# Altium schematic sheet ESP32_Schematic.SchDoc: ESP32-Wroom32D schematic diagram
size A4; Date: 01/10/2024; Author: Filip Kulka; Revision: 1.0; SheetNumber: 1; SheetTotal: 1; Desc: ESP32 WiFi module custom board for a mobile robot project.; BOM: ESP32_Board - Mobile Robot.BomDoc
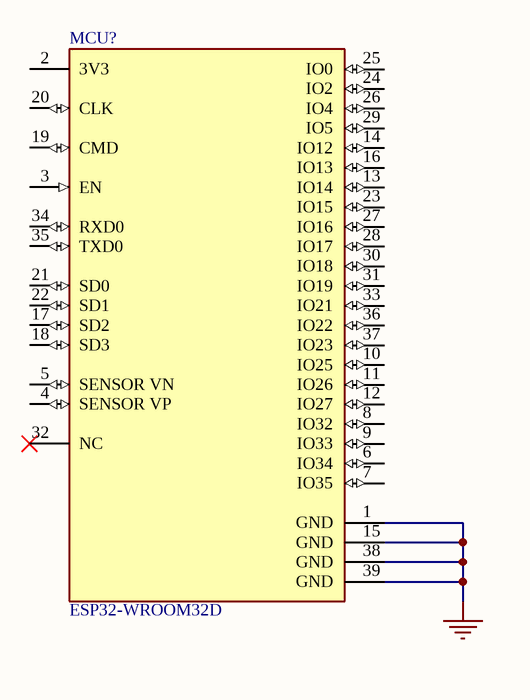
[diagram p0: ESP32_Schematic.SchDoc]

## Parts
?  (no value)
MCU?  ESP32-WROOM32D  [ESP32-Wroom32D]

## Nets
GND: MCU?.1(GND) MCU?.15(GND) MCU?.38(GND) MCU?.39(GND)

Not connected (* = marked no-connect by the designer): MCU? 2(3V3) 3(EN) 4(SENSOR_VP) 5(SENSOR_VN) 6(IO34) 7(IO35) 8(IO32) 9(IO33) 10(IO25) 11(IO26) 12(IO27) 13(IO14) 14(IO12) 16(IO13) 17(SD2) 18(SD3) 19(CMD) 20(CLK) 21(SD0) 22(SD1) 23(IO15) 24(IO2) 25(IO0) 26(IO4) 27(IO16) 28(IO17) 29(IO5) 30(IO18) 31(IO19) 32(NC)* 33(IO21) 34(RXD0) 35(TXD0) 36(IO22) 37(IO23)

## Notes on the sheet
- Author:
- Title:
- Project:
- BOM file:
- Date:
- Last Update:
- Revision:
- Checked by:
- File:
- Desc:
- Sheet
- of

## Library data of the parts
? = TitleBlock: This is a custom title block with my logo and a bit more info than the default one
MCU? = ESP32-WROOM32D: ESP32 WiFi module with a pcb antenna